# EAGLE design dwm1000-breakout (EAGLE 8.2.2)
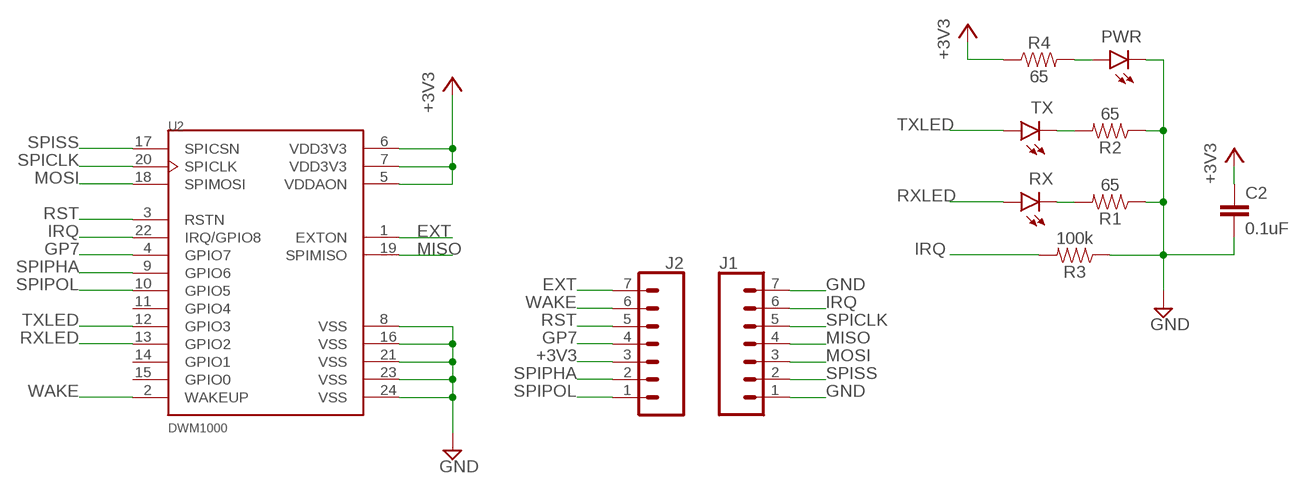
[diagram p0: schematic, sheet 1]

## Parts
C2  0.1uF  CAPACITOR_NP_1210  [C1210]
J1  CONN_07LOCK  [1X07_LOCK]
J2  CONN_07LOCK  [1X07_LOCK]
PWR  GREEN  LED-GREEN1206  [LED-1206]
R1  65  RESISTOR1206  [1206]
R2  65  RESISTOR1206  [1206]
R3  100k  RESISTOR1206  [1206]
R4  65  RESISTOR1206  [1206]
RX  GREEN  LED-GREEN1206  [LED-1206]
TX  GREEN  LED-GREEN1206  [LED-1206]
U2  DWM1000  [XCVR_DWM1000]

## Nets
+3V3: C2.P$1 J2.3 R4.1 U2.5(VDDAON) U2.6(VDD3V3) U2.7(VDD3V3)
EXT: J2.7 U2.1(EXTON)
GND: C2.P$2 J1.1 J1.7 PWR.C R1.1 R2.1 R3.1 U2.8(VSS) U2.16(VSS) U2.21(VSS) U2.23(VSS) U2.24(VSS)
GP7: J2.4 U2.4(GPIO7)
IRQ: J1.6 R3.2 U2.22(IRQ/GPIO8)
MISO: J1.4 U2.19(SPIMISO)
MOSI: J1.3 U2.18(SPIMOSI)
N$1: R1.2 RX.C
N$2: R2.2 TX.C
N$3: PWR.A R4.2
RST: J2.5 U2.3(RSTN)
RXLED: RX.A U2.13(GPIO2)
SPICLK: J1.5 U2.20(SPICLK)
SPIPHA: J2.2 U2.9(GPIO6)
SPIPOL: J2.1 U2.10(GPIO5)
SPISS: J1.2 U2.17(SPICSN)
TXLED: TX.A U2.12(GPIO3)
WAKE: J2.6 U2.2(WAKEUP)
Unconnected: U2.11(GPIO4) U2.14(GPIO1) U2.15(GPIO0)

## Library data of the parts
C2 = Passives:CAPACITOR_NP: Library: Passives Description: Device for Non-Polarized Capacitors. Manufacture part number (MPN), Voltage, Temperature Coefficient, and Tolerance can be added via Attributes.; DIGIKEY: N/A; DIGIKEY_PARTNUM: 1276-2854-1-ND; MPN: N/A; TEMP_COF: N/A; TOLERANCE: N/A; VOLTAGE: N/A
J1 J2 = SparkFun-Connectors:CONN_07: Multi connection point. Often used as Generic Header-pin footprint for 0.1 inch spaced/style header connections On any of the 0.1 inch spaced packages, you can populate with these: Break Away Headers - Straight <https://www.sparkfun.com/products/116> (PRT-00116) Break Away Male Headers - Right Angle <https://www.sparkfun.com/products/553> (PRT-00553) Female Headers <https://www.sparkfun.com/products/115> (PRT-00115) Break Away Headers - Machine Pin <https://www.sparkfun.com/products/117> (PRT-00117) Break Away Female Headers - Swiss Machine Pin <https://www.sparkfun.com/products/743> (PRT-00743) For SCREWTERMINALS and SPRING TERMINALS visit here: Screw Terimnals on SparkFun.com <https://www.sparkfun.com/search/results?term=Screw+Terminals> (5mm/3.5mm/2.54mm spacing) This device is also useful as a general connection point to wire up your design to another part of your project. Our various solder wires solder well into these plated through hole pads. Hook-Up Wire - Assortment (Stranded, 22 AWG) <https://www.sparkfun.com/products/11375> (PRT-11375) Hook-Up Wire - Assortment (Solid Core, 22 AWG) <https://www.sparkfun.com/products/11367> (PRT-11367) View the entire wire category on our website here <https://www.sparkfun.com/categories/141> Special notes: Molex polarized connector foot print use with SKU : PRT-08231 with associated crimp pins and housings. 1MM SMD Version SKU: PRT-10208 NOTES ON THE VARIANTS LOCK and LOCK_LONGPADS... This footprint was designed to help hold the alignment of a through-hole component (i.e. 6-pin header) while soldering it into place. You may notice that each hole has been shifted either up or down by 0.005 of an inch from it's more standard position (which is a perfectly straight line). This slight alteration caused the pins (the squares in the middle) to touch the edges of the holes. Because they are alternating, it causes a "brace" to hold the component in place. 0.005 has proven to be the perfect amount of "off-center" position when using our standard breakaway headers. Although looks a little odd when you look at the bare footprint, once you have a header in there, the alteration is very hard to notice. Also,if you push a header all the way into place, it is covered up entirely on the bottom side.; DIGIKEY_PARTNUM: A26509-07-ND
PWR RX = SparkFun-LED:LED-GREEN: Green SMD LED Used in manufacturing of various products at SparkFun Packages: 0603 - SMD 0603 package [Product Link] <http://www.futureelectronics.com/en/technologies/semiconductors/optoelectronics/leds/Pages/9894312-LTST-C190GKT.aspx?CrossPart=HSMG-C190&IM=0> LilyPad 1206 - SMD1206 LilyPad package [Product Link] <http://www.futureelectronics.com/en/Technologies/Product.aspx?ProductID=IN150NGHARVATEKCORPORATION2049943&IM=0> 1206 - SMD1206 package [Product Link] <http://www.futureelectronics.com/en/technologies/semiconductors/optoelectronics/leds/Pages/8315665-LTST-C150KGKT.aspx?IM=0> 1206 Bottom Mount -SMD 1206 Bottom Mount [Product Link] <http://www.digikey.com/product-detail/en/lite-on-inc/LTST-C230KGKT/160-1456-1-ND/386854> SparkFun Products: Pro Mini 328 -5V <https://www.sparkfun.com/products/821> RedBoard <https://www.sparkfun.com/products/12757> MP3 Trigger <https://www.sparkfun.com/products/13720> Makey Makey <https://www.sparkfun.com/products/11076>; DIGIKEY_PARTNUM: 350-2053-1-ND; PROD_ID: DIO-00862
R1 R2 R4 = SparkFun-Resistors:RESISTOR: Generic Resistor Package; DIGIKEY_PARTNUM: 311-64.9FRCT-ND
R3 = SparkFun-Resistors:RESISTOR: Generic Resistor Package; DIGIKEY_PARTNUM: 311-100KERCT-ND
TX = SparkFun-LED:LED-GREEN: Green SMD LED Used in manufacturing of various products at SparkFun Packages: 0603 - SMD 0603 package [Product Link] <http://www.futureelectronics.com/en/technologies/semiconductors/optoelectronics/leds/Pages/9894312-LTST-C190GKT.aspx?CrossPart=HSMG-C190&IM=0> LilyPad 1206 - SMD1206 LilyPad package [Product Link] <http://www.futureelectronics.com/en/Technologies/Product.aspx?ProductID=IN150NGHARVATEKCORPORATION2049943&IM=0> 1206 - SMD1206 package [Product Link] <http://www.futureelectronics.com/en/technologies/semiconductors/optoelectronics/leds/Pages/8315665-LTST-C150KGKT.aspx?IM=0> 1206 Bottom Mount -SMD 1206 Bottom Mount [Product Link] <http://www.digikey.com/product-detail/en/lite-on-inc/LTST-C230KGKT/160-1456-1-ND/386854> SparkFun Products: Pro Mini 328 -5V <https://www.sparkfun.com/products/821> RedBoard <https://www.sparkfun.com/products/12757> MP3 Trigger <https://www.sparkfun.com/products/13720> Makey Makey <https://www.sparkfun.com/products/11076>; PROD_ID: DIO-00862
U2 = DWM1000:DWM1000: Mod Ieee802.15.4-2011 Uwb Txrx; AVAILABILITY: Good; DESCRIPTION: Mod Ieee802.15.4-2011 Uwb Txrx; DIGIKEY_PARTNUM: 1479-1002-1-ND; MF: Decawave; MP: DWM1000; PACKAGE: None; PRICE: 20.95 USD

## Board
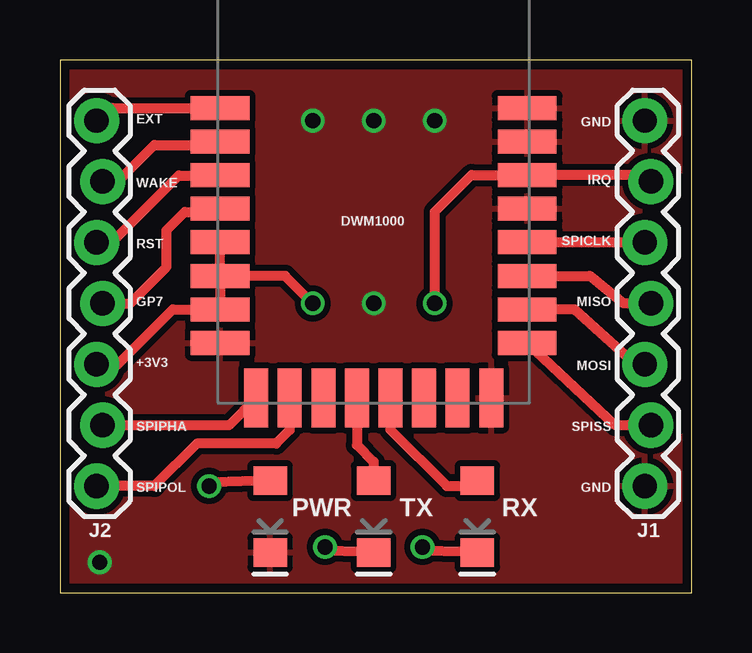
[diagram p1: board, top side]
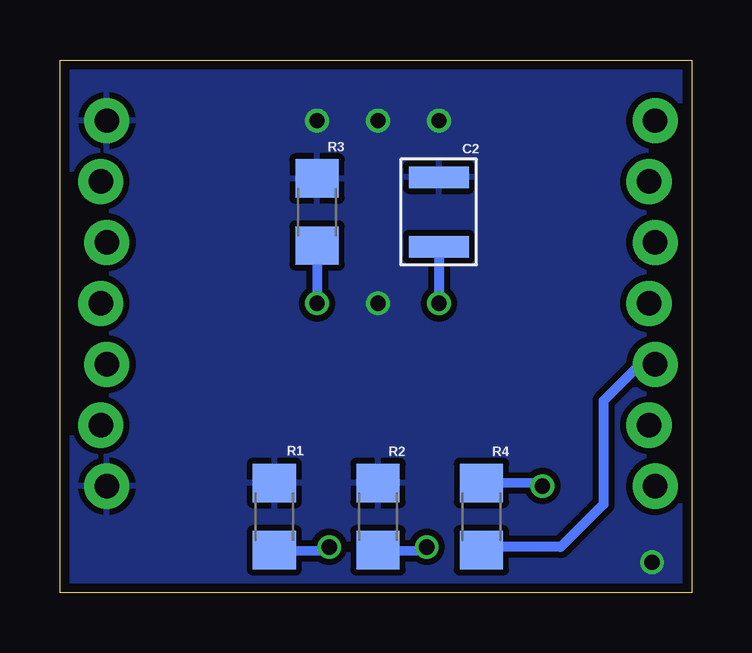
[diagram p2: board, bottom side, seen from below]

Size 26.34 x 22.21 mm. Coordinates in mm from the lower left corner, seen from the top.
Outline: 0,0 26.34,0 26.34,22.21 0,22.21 0,0
Copper layers (1*16): Top 0.0356mm / dielectric 1.5011mm / Bottom 0.0356mm
Design rules "LaenPCBOrder": minimum track width 6mil, minimum drill 13mil, track to track 6mil, track to pad 6mil, pad to pad 6mil, via to via 6mil, smd to smd 6mil, copper to edge 15mil, drill to drill 6mil, minimum pad ring 7mil, minimum via ring 7mil, stop-mask expansion 3mil, vias tented up to drill 0mil, thermal gap 10mil

### Footprints (pad centres in the part's own frame; a part is rotated, then mirrored left to right if it is on the bottom)
C1210 = smd 0.9 x 2.5: P$1 -1.45,0; P$2 1.45,0
1X07_LOCK = drill 1.016 pad 1.88: 1 0,0.127; 2 2.54,-0.127; 3 5.08,0.127; 4 7.62,-0.127; 5 10.16,0.127; 6 12.7,-0.127; 7 15.24,0.127
LED-1206 = smd 1.2 x 1.4: A -1.5,0; C 1.5,0
1206 = smd 1.6 x 1.8: 1 -1.4,0; 2 1.4,0
XCVR_DWM1000 = smd 2.45 x 1: 1 -6.4,1.8; 2 -6.4,0.4; 3 -6.4,-1; 4 -6.4,-2.4; 5 -6.4,-3.8; 6 -6.4,-5.2; 7 -6.4,-6.6; 8 -6.4,-8; 17 6.4,-8; 18 6.4,-6.6; 19 6.4,-5.2; 20 6.4,-3.8; 21 6.4,-2.4; 22 6.4,-1; 23 6.4,0.4; 24 6.4,1.8 | smd 1 x 2.45: 9 -4.9,-10.295; 10 -3.5,-10.295; 11 -2.1,-10.295; 12 -0.7,-10.295; 13 0.7,-10.295; 14 2.1,-10.295; 15 3.5,-10.295; 16 4.9,-10.295

### Placement (x,y rotation side)
C2  10.54,15.88 90 bottom
J1  24.51,4.45 90 top
J2  1.65,4.45 90 top
PWR  8.76,3.17 270 top
R1  17.4,3.17 270 bottom
R2  13.08,3.17 270 bottom
R3  15.62,15.88 270 bottom
R4  8.76,3.17 90 bottom
RX  17.4,3.17 270 top
TX  13.08,3.17 270 top
U2  13.08,18.41 0 top

### Tracks (layer width: path | path; a pad name or v marks a point on that pad's centre or on a via)
+3V3  (via drill 0.64)
  Top 0.406: v10.54,12.07 9.39,13.21 U2.6 | U2.6 U2.7 4.7,11.82 2.41,9.52 J2.3 | U2.6 U2.5
  Bottom 0.406: C2.P$1 v10.54,12.07 | R4.1 8.61,1.91 5.46,1.91 3.68,3.68 3.68,8 2.16,9.52 J2.3
EXT
  Top 0.406: U2.1 2.18,20.21 J2.7
GND  (via drill 0.64)
  other vias: 1.65,1.27 13.08,19.68 10.54,19.68 15.62,19.68 13.08,12.07
  pour Bottom (isolate 0.254): 0.38,22.22 30.86,22.22 30.86,20.95 30.86,-1.9 -0.89,-1.9 -0.89,-0.63 -0.89,22.22
  pour Top (isolate 0.254): 29.34,22.22 -1.14,22.22 -1.14,20.95 -1.14,-1.9 30.61,-1.9 30.61,-0.63 30.61,22.22
GP7
  Top 0.406: U2.4 6.54,15.88 5.21,15.88 4.45,15.11 4.45,13.59 2.92,12.07 J2.4
IRQ  (via drill 0.64)
  Top 0.406: v15.62,12.07 15.62,15.88 17.16,17.41 U2.22 24.11,17.41 J1.6
  Bottom 0.406: R3.2 v15.62,12.07
MISO
  Top 0.406: U2.19 22.09,13.21 23.5,12.07 J1.4
MOSI
  Top 0.406: U2.18 21.46,11.81 24,9.52 J1.3
N$1  (via drill 0.64)
  Top 0.406: RX.C 15.27,1.75 v15.11,1.91
  Bottom 0.406: 16.74,1.91 R1.2 15.27,1.75 v15.11,1.91
N$2  (via drill 0.64)
  Top 0.406: TX.C 11.2,1.75 v11.05,1.91
  Bottom 0.406: R2.2 11.2,1.75 v11.05,1.91
N$3  (via drill 0.64)
  Top 0.406: PWR.A 6.38,4.6 v6.22,4.45
  Bottom 0.406: R4.2 6.38,4.6 v6.22,4.45
RST
  Top 0.406: U2.3 6.67,17.4 4.95,17.4 2.16,14.61 J2.5
RXLED
  Top 0.406: U2.13 13.78,6.79 16.13,4.45 16.74,4.45 RX.A
SPICLK
  Top 0.406: J1.5 24.25,14.61 U2.20
SPIPHA
  Top 0.406: U2.9 7.05,6.99 J2.2
SPIPOL
  Top 0.406: U2.10 9.58,6.79 9.02,6.22 5.71,6.22 3.94,4.45 J2.1
SPISS
  Top 0.406: J1.2 23.16,6.99 U2.17
TXLED
  Top 0.406: TX.A 13.08,5.46 12.38,6.16 U2.12
WAKE
  Top 0.406: U2.2 6.54,18.67 3.94,18.67 2.41,17.14 J2.6

### Text on the board
tNames: EXT | GND | WAKE | IRQ | RST | SPICLK | GP7 | MISO | +3V3 | MOSI | SPIPHA | SPISS | SPIPOL | GND